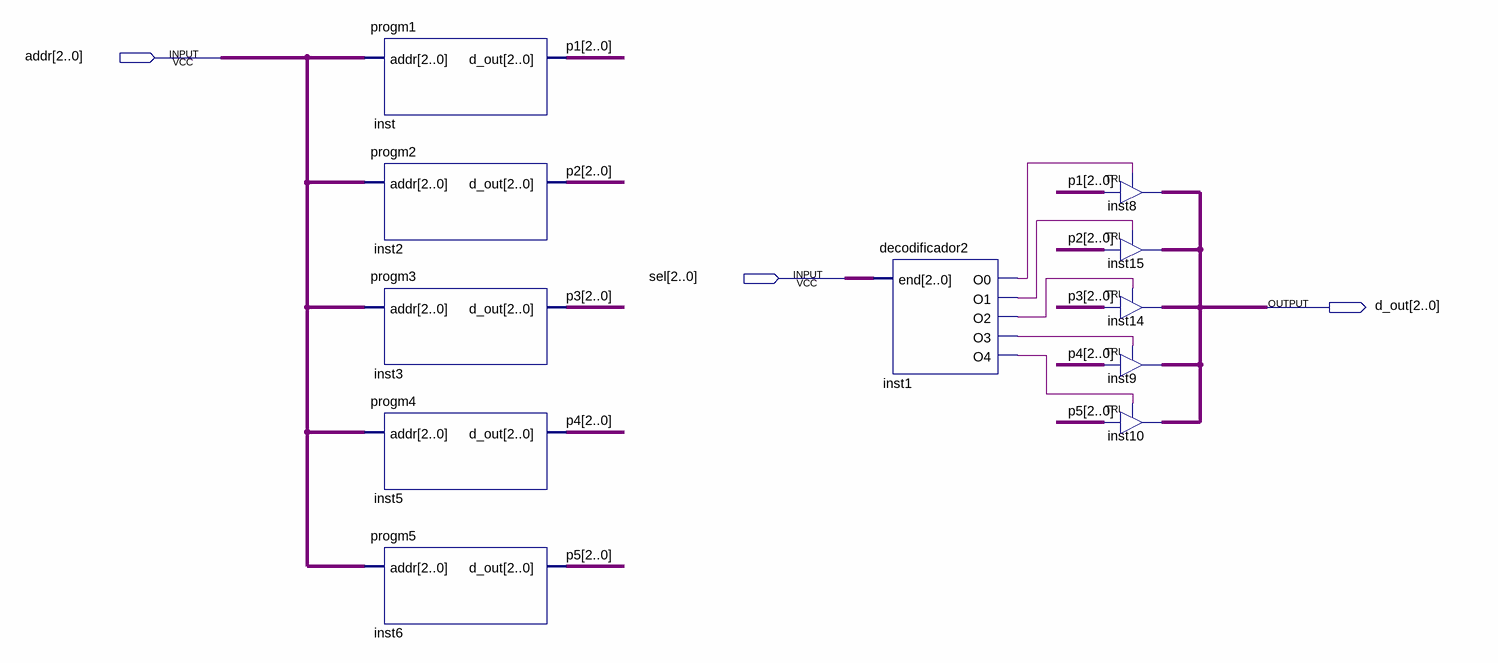
[diagram p0: schematic sheet]
// Quartus schematic banco-rom.bdf as structural Verilog: 11 symbols, 3 pins
module \banco-rom  (
  input  [2:0] addr,
  input  [2:0] sel,
  output [2:0] d_out
);

  wire inst1_o0, inst1_o1, inst1_o2, inst1_o3, inst1_o4;
  wire [2:0] p1, p2, p3, p4, p5;

  progm1 inst (.addr(addr), .d_out(p1));
  progm2 inst2 (.addr(addr), .d_out(p2));
  progm3 inst3 (.addr(addr), .d_out(p3));
  progm4 inst5 (.addr(addr), .d_out(p4));
  progm5 inst6 (.addr(addr), .d_out(p5));
  decodificador2 inst1 (.\end (sel), .O0(inst1_o0), .O1(inst1_o1), .O2(inst1_o2), .O3(inst1_o3), .O4(inst1_o4));
  TRI inst8[2:0] (.IN(p1), .OE(inst1_o0), .OUT(d_out));
  TRI inst15[2:0] (.IN(p2), .OE(inst1_o1), .OUT(d_out));
  TRI inst14[2:0] (.IN(p3), .OE(inst1_o2), .OUT(d_out));
  TRI inst9[2:0] (.IN(p4), .OE(inst1_o3), .OUT(d_out));
  TRI inst10[2:0] (.IN(p5), .OE(inst1_o4), .OUT(d_out));
endmodule
